# EAGLE design sidi-base (EAGLE 6.4)
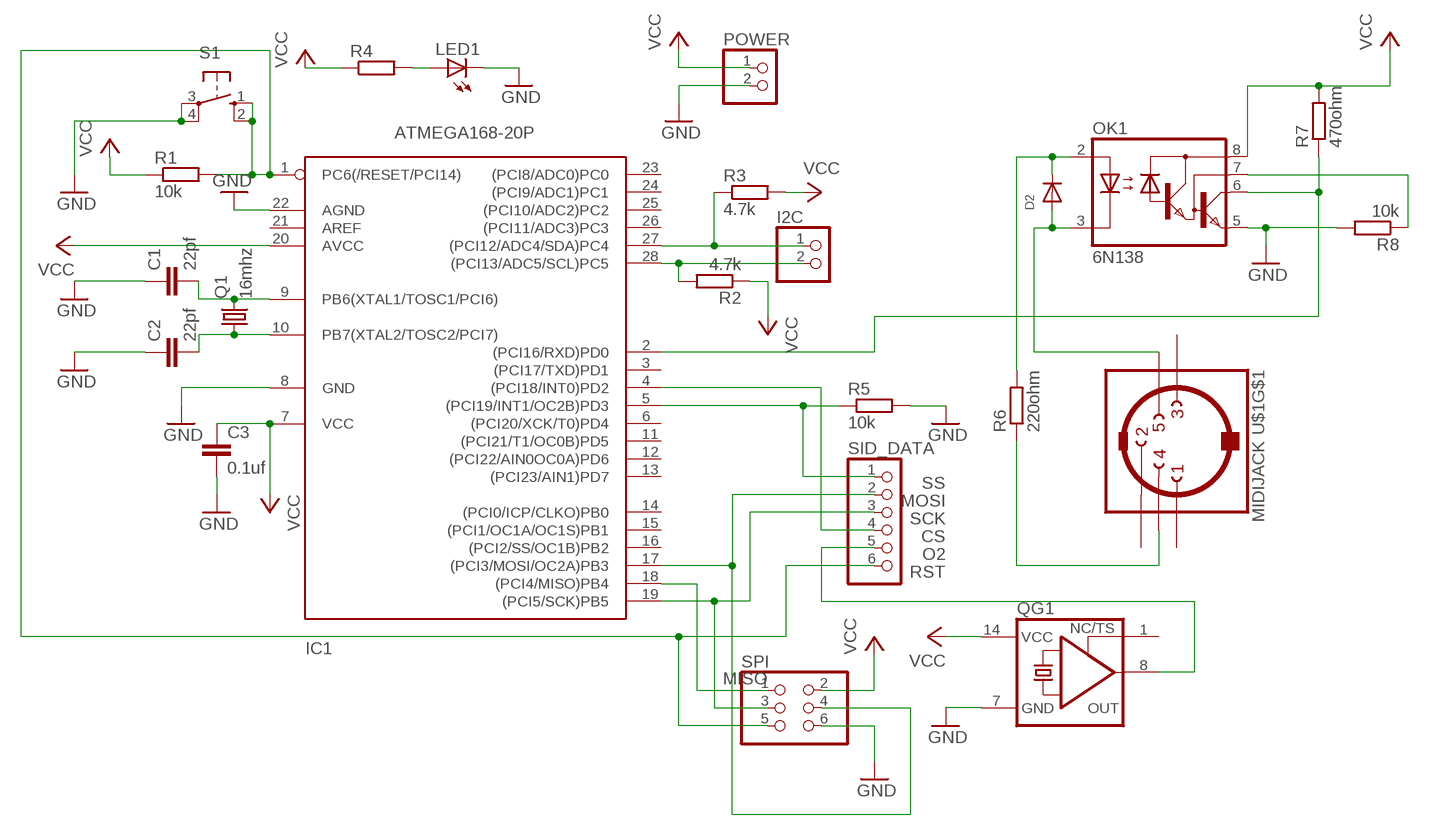
[diagram p0: schematic, sheet 1]

## Parts
C1  22pf  C-EU050-050X075  [C050-050X075]
C2  22pf  C-EU050-050X075  [C050-050X075]
C3  0.1uf  C-EU050-050X075  [C050-050X075]
D2  DIODEDO-1N4148  [DO-1N4148]
I2C  PINHD-1X2  [1X02]
IC1  ATMEGA168-20P  [DIL28-3]
LED1  LED3MM  [LED3MM]
OK1  6N138  [DIL08]
POWER  PINHD-1X2  [1X02]
Q1  16mhz  CRYSTALHC49S  [HC49/S]
QG1  XO-14  [DIL14S]
R1  10k  R-EU_0207/7  [0207/7]
R2  4.7k  R-EU_0207/7  [0207/7]
R3  4.7k  R-EU_0207/7  [0207/7]
R4  R-EU_0207/7  [0207/7]
R5  10k  R-EU_0207/7  [0207/7]
R6  220ohm  R-EU_0207/7  [0207/7]
R7  470ohm  R-EU_0207/7  [0207/7]
R8  10k  R-EU_0207/7  [0207/7]
S1  10-XX  [B3F-10XX]
SID_DATA  PINHD-1X6  [1X06]
SPI  PINHD-2X3  [2X03]
U$1  MIDIJACK  [CP-2350]

## Nets
CS: IC1.4((PCI18/INT0)PD2) SID_DATA.4
GND: C1.1 C2.1 C3.2 IC1.8(GND) IC1.22(AGND) LED1.K(C) OK1.5(GND) POWER.2 QG1.7(GND) R5.2 R8.2 S1.3(P) S1.4(P1) SPI.6
MISO: IC1.18((PCI4/MISO)PB4) SPI.1
MOSI: IC1.17((PCI3/MOSI/OC2A)PB3) SID_DATA.2 SPI.4
N$1: OK1.7(VB) R8.1
N$5: LED1.A R4.2
N$6: C1.2 IC1.9(PB6(XTAL1/TOSC1/PCI6)) Q1.2
N$7: C2.2 IC1.10(PB7(XTAL2/TOSC2/PCI7)) Q1.1
N$16: I2C.1 IC1.27((PCI12/ADC4/SDA)PC4) R3.1
N$17: I2C.2 IC1.28((PCI13/ADC5/SCL)PC5) R2.2
N$18: D2.A OK1.3(C) U$1.5
N$19: R6.1 U$1.4
N$20: D2.C OK1.2(A) R6.2
N$23: IC1.2((PCI16/RXD)PD0) OK1.6(VO) R7.1
O2: QG1.8(OUT) SID_DATA.5
RST: IC1.1(PC6(/RESET/PCI14)) R1.2 S1.1(S) S1.2(S1) SID_DATA.6 SPI.5
SCK: IC1.19((PCI5/SCK)PB5) SID_DATA.3 SPI.3
SS: IC1.5((PCI19/INT1/OC2B)PD3) R5.1 SID_DATA.1
VCC: C3.1 IC1.7(VCC) IC1.20(AVCC) OK1.8(VCC) POWER.1 QG1.14(VCC) R1.1 R2.1 R3.2 R4.1 R7.2 SPI.2
Unconnected: IC1.3((PCI17/TXD)PD1) IC1.6((PCI20/XCK/T0)PD4) IC1.11((PCI21/T1/OC0B)PD5) IC1.12((PCI22/AIN0OC0A)PD6) IC1.13((PCI23/AIN1)PD7) IC1.14((PCI0/ICP/CLKO)PB0) IC1.15((PCI1/OC1A/OC1S)PB1) IC1.16((PCI2/SS/OC1B)PB2) IC1.21(AREF) IC1.23((PCI8/ADC0)PC0) IC1.24((PCI9/ADC1)PC1) IC1.25((PCI10/ADC2)PC2) IC1.26((PCI11/ADC3)PC3) QG1.1(TS) U$1.1 U$1.2 U$1.3 U$1.PE1(MT) U$1.PE2(MT) U$1.PE(MT) U$1.PE@(MT)

## Library data of the parts
C1-C3 = rcl:C-EU: CAPACITOR, European symbol
D2 = adafruit:DIODE: Diode SMADIODE - SMA Surface Mount Package 20V 1A Schottky Diode Digikey: 641-1014-6-ND DO-1N4148 - Through Hole Small Current Diode SOD-123 20V 1 A (.5mV Vf) Schottky Diode - Digikey: MBRX120TPMSCT-ND SOD-323 10V 570mA (.38mV Vf, 3ns) Schottky Diode - Digikey: ZLLS410CT-ND SOD-523 30V 30mA Schottky Diode (RB751S-40TE61) - Digikey: RB751S-40TE61CT-ND SOT23-R/W - SOT23 Package (R = Solder Paste/Reflow Ovens, W = Hand-Soldering) BAT54Film 40V 300mA - Digikey: 497-7162-1-ND
I2C POWER = pinhead:PINHD-1X2: PIN HEADER
IC1 = adafruit:ATMEGA168*P: MICROCONTROLLER 16 kBytes FLASH 1 kBytes SRAM 512 Bytes EEPROM USART 8-channel 10 bit ADC
LED1 = led:LED: LED OSRAM: - CHIPLED LG R971, LG N971, LY N971, LG Q971, LY Q971, LO R971, LY R971 LH N974, LH R974 LS Q976, LO Q976, LY Q976 LO Q996 - Hyper CHIPLED LW Q18S LB Q993, LB Q99A, LB R99A - SideLED LS A670, LO A670, LY A670, LG A670, LP A670 LB A673, LV A673, LT A673, LW A673 LH A674 LY A675 LS A676, LA A676, LO A676, LY A676, LW A676 LS A679, LY A679, LG A679 - Hyper Micro SIDELED® LS Y876, LA Y876, LO Y876, LY Y876 LT Y87S - SmartLED LW L88C, LW L88S LB L89C, LB L89S, LG L890 LS L89K, LO L89K, LY L89K LS L896, LA L896, LO L896, LY L896 - TOPLED LS T670, LO T670, LY T670, LG T670, LP T670 LSG T670, LSP T670, LSY T670, LOP T670, LYG T670 LG T671, LOG T671, LSG T671 LB T673, LV T673, LT T673, LW T673 LH T674 LS T676, LA T676, LO T676, LY T676, LB T676, LH T676, LSB T676, LW T676 LB T67C, LV T67C, LT T67C, LS T67K, LO T67K, LY T67K, LW E67C LS E67B, LA E67B, LO E67B, LY E67B, LB E67C, LV E67C, LT E67C LW T67C LS T679, LY T679, LG T679 LS T770, LO T770, LY T770, LG T770, LP T770 LB T773, LV T773, LT T773, LW T773 LH T774 LS E675, LA E675, LY E675, LS T675 LS T776, LA T776, LO T776, LY T776, LB T776 LHGB T686 LT T68C, LB T68C - Hyper Mini TOPLED® LB M676 - Mini TOPLED Santana® LG M470 LS M47K, LO M47K, LY M47K Source: http://www.osram.convergy.de LUXEON: - LUMILED® LXK2-PW12-R00, LXK2-PW12-S00, LXK2-PW14-U00, LXK2-PW14-V00 LXK2-PM12-R00, LXK2-PM12-S00, LXK2-PM14-U00 LXK2-PE12-Q00, LXK2-PE12-R00, LXK2-PE12-S00, LXK2-PE14-T00, LXK2-PE14-U00 LXK2-PB12-K00, LXK2-PB12-L00, LXK2-PB12-M00, LXK2-PB14-N00, LXK2-PB14-P00, LXK2-PB14-Q00 LXK2-PR12-L00, LXK2-PR12-M00, LXK2-PR14-Q00, LXK2-PR14-R00 LXK2-PD12-Q00, LXK2-PD12-R00, LXK2-PD12-S00 LXK2-PH12-R00, LXK2-PH12-S00 LXK2-PL12-P00, LXK2-PL12-Q00, LXK2-PL12-R00 Source: www.luxeon.com KINGBRIGHT: KA-3528ASYC Source: www.kingbright.com
OK1 = optocoupler:6N138: MOTOROLA OPTO COUPLER; MF: VISHAY/TELEFUNKEN; MPN: 6N138; OC_FARNELL: 9860150; OC_NEWARK: 35K5294
Q1 = crystal:CRYSTAL: CRYSTAL; OC_FARNELL: 1667008; OC_NEWARK: unknown
QG1 = crystal:XO-: CRYSTAL; OC_FARNELL: unknown; OC_NEWARK: unknown
R1-R8 = resistor:R-EU_: RESISTOR, European symbol
S1 = switch-omron:10-XX: OMRON SWITCH; MPN: B3F-1000; OC_FARNELL: 176432; OC_NEWARK: 36M3542
SID_DATA = pinhead:PINHD-1X6: PIN HEADER
SPI = pinhead:PINHD-2X3: PIN HEADER
U$1 = adafruit:MIDIJACK: DIN 5 jack also known as MIDI jack A modification of conn-hirshman:MAB5SH with two options for the grounding 'teeth'

## Board
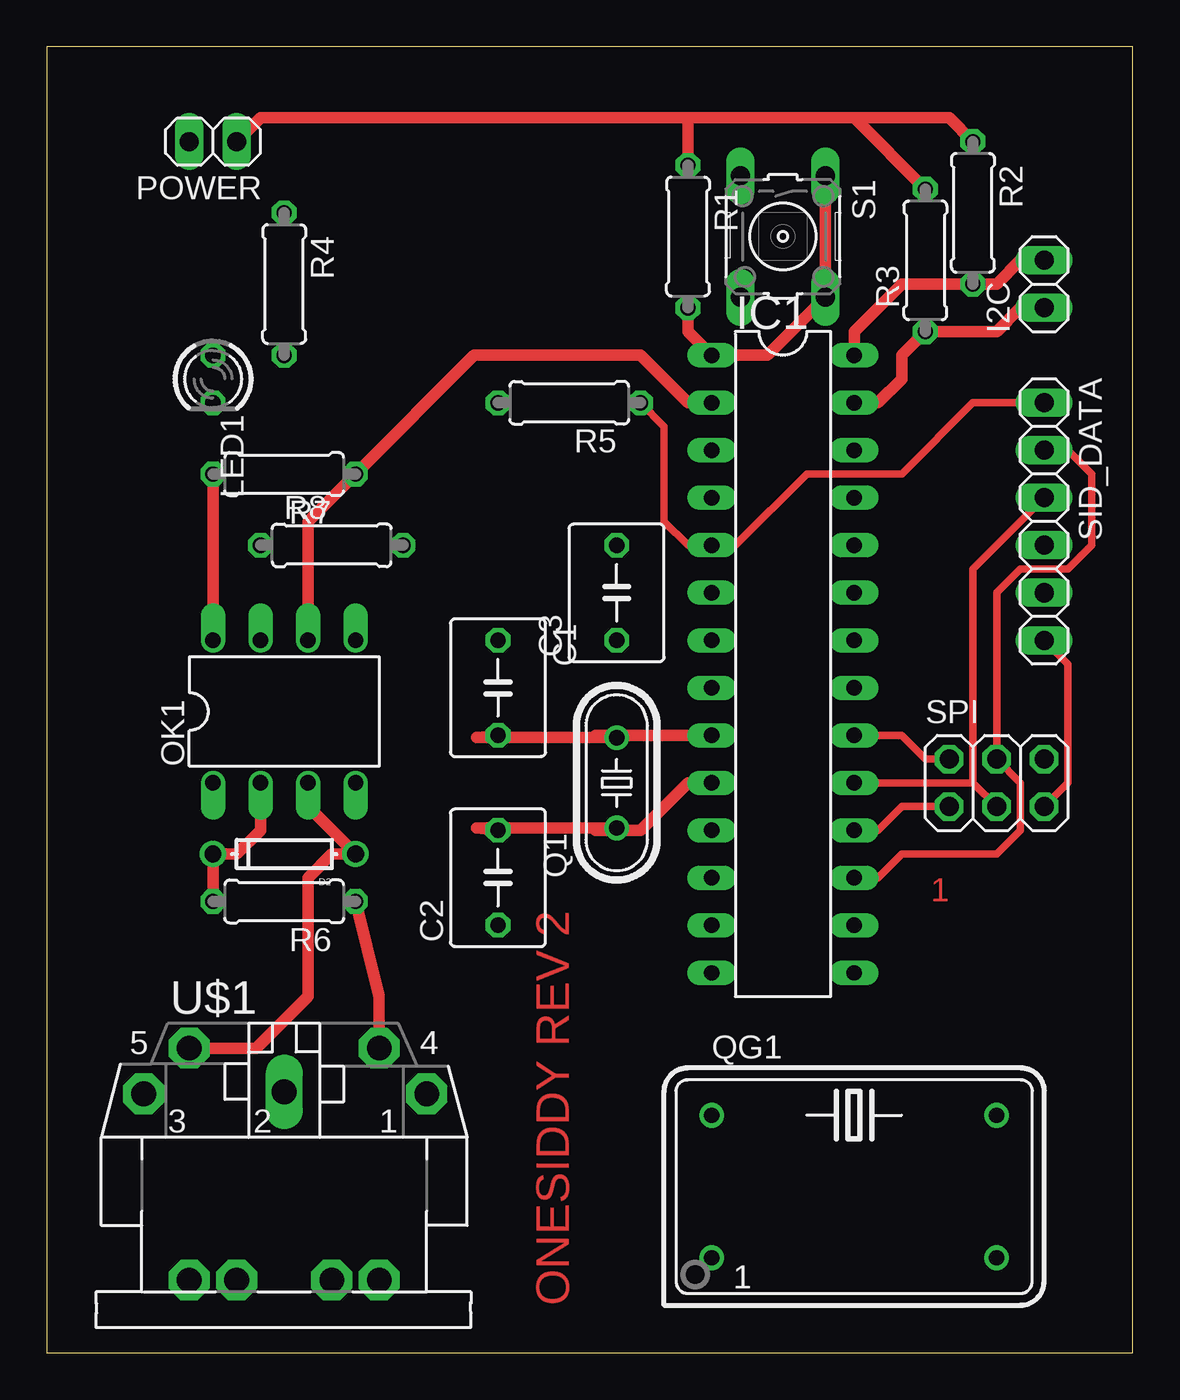
[diagram p1: board, top side]
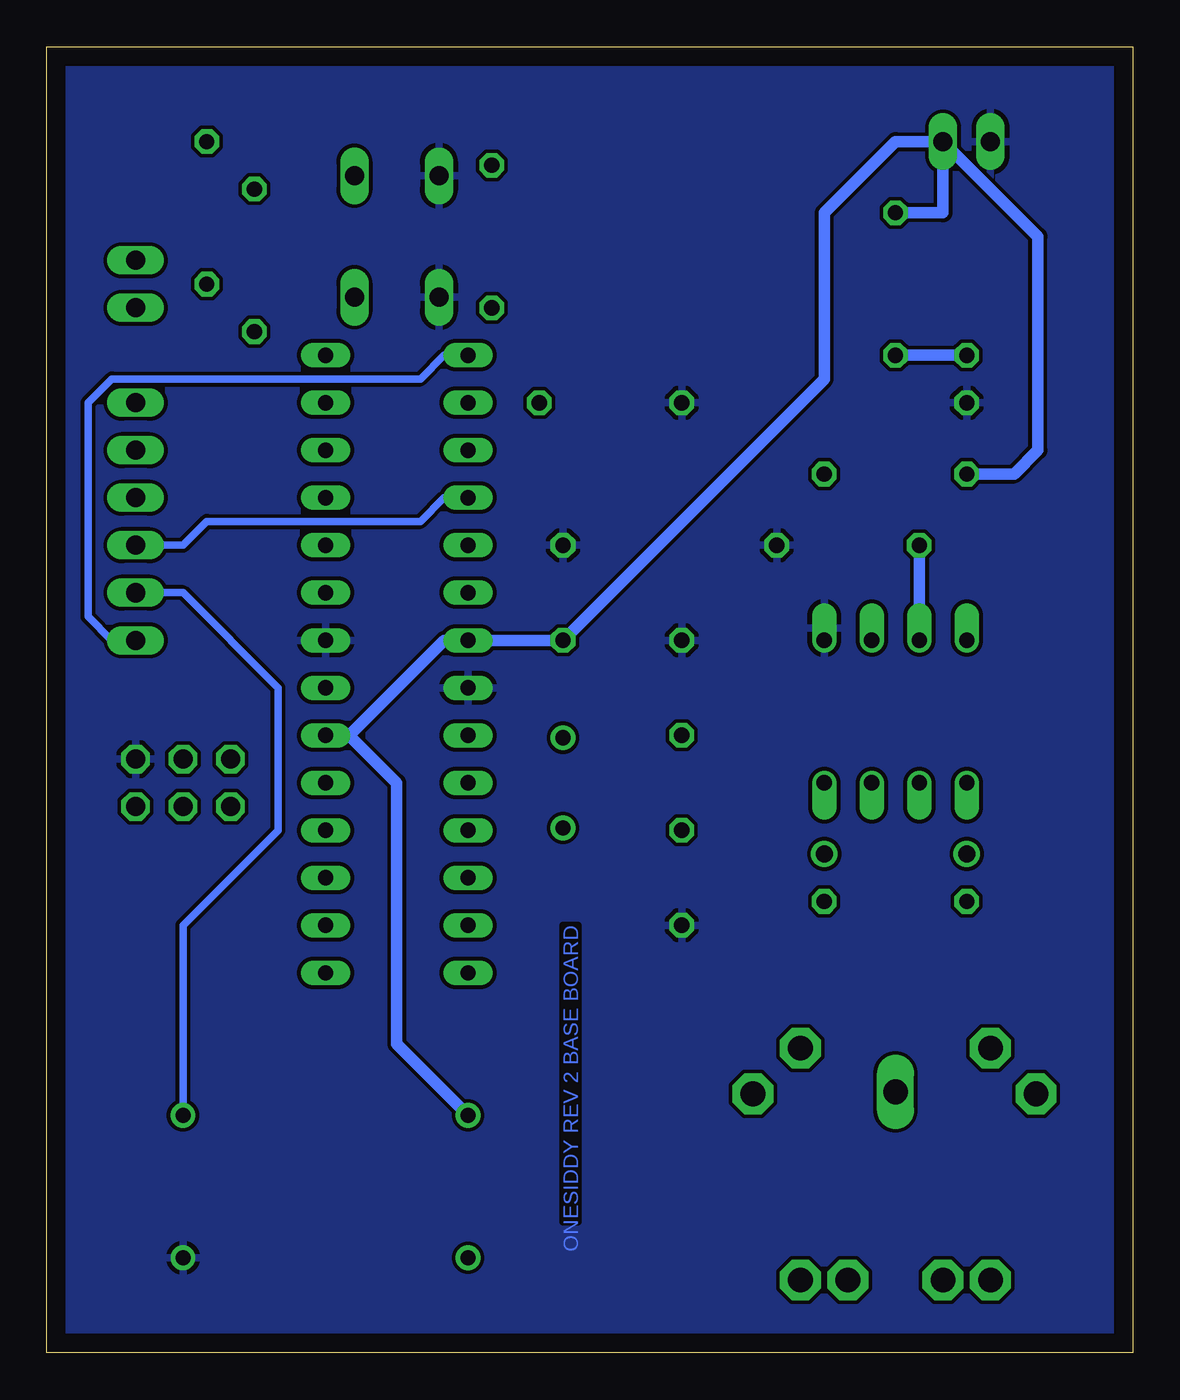
[diagram p2: board, bottom side, seen from below]

Size 58.09 x 69.84 mm. Coordinates in mm from the lower left corner, seen from the top.
Outline: 0,0 58.09,0 58.09,69.84 0,69.84 0,0
Copper layers (1*16): Top 0.035mm / dielectric 1.5mm / Bottom 0.035mm
Design rules "default": minimum track width 10mil, minimum drill 24mil, track to track 8mil, track to pad 8mil, pad to pad 8mil, via to via 8mil, smd to smd 8mil, copper to edge 40mil, drill to drill 8mil, minimum pad ring 10mil, minimum via ring 8mil, stop-mask expansion 4mil, vias tented up to drill 0mil, thermal gap 10mil

### Footprints (pad centres in the part's own frame; a part is rotated, then mirrored left to right if it is on the bottom)
C050-050X075 = drill 0.813 octagon: 1 -2.54,0; 2 2.54,0
DO-1N4148 = drill 0.9: A -3.81,0; C 3.81,0
1X02 = drill 1.016 long: 1 -1.27,0; 2 1.27,0
DIL28-3 = drill 0.813 long: 1 -16.51,-3.81; 2 -13.97,-3.81; 3 -11.43,-3.81; 4 -8.89,-3.81; 5 -6.35,-3.81; 6 -3.81,-3.81; 7 -1.27,-3.81; 8 1.27,-3.81; 9 3.81,-3.81; 10 6.35,-3.81; 11 8.89,-3.81; 12 11.43,-3.81; 13 13.97,-3.81; 14 16.51,-3.81; 15 16.51,3.81; 16 13.97,3.81; 17 11.43,3.81; 18 8.89,3.81; 19 6.35,3.81; 20 3.81,3.81; 21 1.27,3.81; 22 -1.27,3.81; 23 -3.81,3.81; 24 -6.35,3.81; 25 -8.89,3.81; 26 -11.43,3.81; 27 -13.97,3.81; 28 -16.51,3.81
LED3MM = drill 0.813 octagon: A -1.27,0; K 1.27,0
DIL08 = drill 0.813 offset: 1 -3.81,-3.81; 2 -1.27,-3.81; 3 1.27,-3.81; 4 3.81,-3.81; 5 3.81,3.81; 6 1.27,3.81; 7 -1.27,3.81; 8 -3.81,3.81
HC49/S = drill 0.813: 1 -2.413,0; 2 2.413,0
DIL14S = drill 0.813: 1 -7.62,-3.81; 7 7.62,-3.81; 8 7.62,3.81; 14 -7.62,3.81
0207/7 = drill 0.813 octagon: 1 -3.81,0; 2 3.81,0
B3F-10XX = drill 1.016 long: 1 -3.251,2.261; 2 3.251,2.261; 3 -3.251,-2.261; 4 3.251,-2.261
1X06 = drill 1.016 long: 1 -6.35,0; 2 -3.81,0; 3 -1.27,0; 4 1.27,0; 5 3.81,0; 6 6.35,0
2X03 = drill 1.016 octagon: 1 -2.54,-1.27; 2 -2.54,1.27; 3 0,-1.27; 4 0,1.27; 5 2.54,-1.27; 6 2.54,1.27
CP-2350 = drill 1.321 pad 2.184 octagon: 1 7.62,12.58; 3 -7.52,12.58; 4 5.08,15.02; 5 -5.08,15.02; PE -2.54,2.62; PE1 -5.08,2.62; PE2 5.08,2.62; PE@ 2.54,2.62 | drill 1.321 long: 2 0,12.68

### Placement (x,y rotation side)
C1  24.13,35.56 270 top
C2  24.13,25.4 90 top
C3  30.48,40.64 90 top
D2  12.7,26.67 180 top
I2C  53.34,57.15 90 top
IC1  39.37,36.83 270 top
LED1  8.89,52.07 270 top
OK1  12.7,34.29 0 top
POWER  8.89,64.77 180 top
Q1  30.48,30.48 90 top
QG1  43.18,8.89 0 top
R1  34.29,59.69 270 top
R2  49.53,60.96 270 top
R3  46.99,58.42 90 top
R4  12.7,57.15 270 top
R5  27.94,50.8 180 top
R6  12.7,24.13 180 top
R7  12.7,46.99 180 top
R8  15.24,43.18 0 top
S1  39.37,59.69 270 top
SID_DATA  53.34,44.45 270 top
SPI  50.8,30.48 0 top
U$1  12.7,1.27 0 top

### Tracks (layer width: path | path; a pad name or v marks a point on that pad's centre or on a via)
CS
  Bottom 0.406: SID_DATA.4 50.8,43.18 49.53,44.45 38.1,44.45 36.83,45.72 IC1.4
GND
  pour Bottom: -2.54,71.12 -2.54,-2.54 58.42,-2.54 58.42,71.12
MISO
  Top 0.406: IC1.18 44.45,27.94 45.72,29.21 SPI.1
MOSI
  Top 0.406: IC1.17 44.45,25.4 45.72,26.67 50.8,26.67 52.07,27.94 52.07,30.48 SPI.4 50.8,40.64 52.07,41.91 54.61,41.91 55.88,43.18 55.88,46.99 54.61,48.26 SID_DATA.2
N$1
  Bottom 0.61: R8.1 OK1.7
N$5
  Bottom 0.61: R4.2 LED1.A
N$6
  Top 0.61: IC1.9 29.34,33.02 Q1.2 22.99,32.89 C1.2
N$7
  Top 0.61: IC1.10 34.29,30.48 31.75,27.94 29.34,27.94 Q1.1 22.99,28.07 C2.2
N$16
  Top 0.61: IC1.27 44.45,50.8 45.72,52.07 45.72,53.34 R3.1 50.8,54.61 52.07,55.88 I2C.1
N$17
  Top 0.61: IC1.28 43.18,54.61 45.72,57.15 R2.2 50.8,57.15 52.07,58.42 I2C.2
N$18
  Top 0.61: U$1.5 11.21,16.29 13.97,19.05 13.97,25.4 15.24,26.67 D2.A 13.97,29.21 OK1.3
N$19
  Top 0.61: U$1.4 17.78,19.05 R6.1
N$20
  Top 0.61: OK1.2 11.43,27.94 10.16,26.67 D2.C R6.2
N$23
  Top 0.61: IC1.2 34.29,50.8 31.75,53.34 22.86,53.34 R7.1 13.97,44.45 OK1.6
O2
  Bottom 0.406: QG1.8 50.8,22.86 45.72,27.94 45.72,35.56 50.8,40.64 SID_DATA.5
RST
  Top 0.406: SPI.5 54.61,30.48 54.61,36.83 SID_DATA.6
  Top 0.61: S1.1 S1.2 38.53,53.34 IC1.1 34.29,54.61 R1.2
  Bottom 0.406: SID_DATA.6 54.61,38.1 55.88,39.37 55.88,50.8 54.61,52.07 38.1,52.07 36.83,53.34 IC1.1
SCK
  Top 0.406: IC1.19 49.53,30.48 | 49.53,30.48 SPI.3 | SID_DATA.3 49.53,41.91 49.53,30.48
SS
  Top 0.406: SID_DATA.1 49.53,50.8 45.72,46.99 40.64,46.99 36.83,43.18 IC1.5 34.29,43.18 33.02,44.45 33.02,49.53 R5.1
VCC
  Top 0.406: SPI.2 46.99,31.75 45.72,33.02 IC1.20
  Top 0.61: R3.2 43.18,66.04 | 43.18,66.04 34.29,66.04 | 34.29,66.04 11.43,66.04 POWER.1 | R2.1 48.26,66.04 43.18,66.04 | OK1.8 R7.2 | R1.1 34.29,66.04
  Bottom 0.61: POWER.1 12.7,64.77 16.51,60.96 16.51,52.07 C3.1 IC1.7 36.83,38.1 41.91,33.02 | POWER.1 10.16,60.96 R4.1 | R7.2 6.35,46.99 5.08,48.26 5.08,59.69 POWER.1 | IC1.20 41.91,33.02 | 41.91,33.02 39.37,30.48 39.37,16.51 QG1.14

### Text on the board
Top: 1 | ONESIDDY REV 2
Bottom: ONESIDDY REV 2 BASE BOARD
Document: ONESIDDY